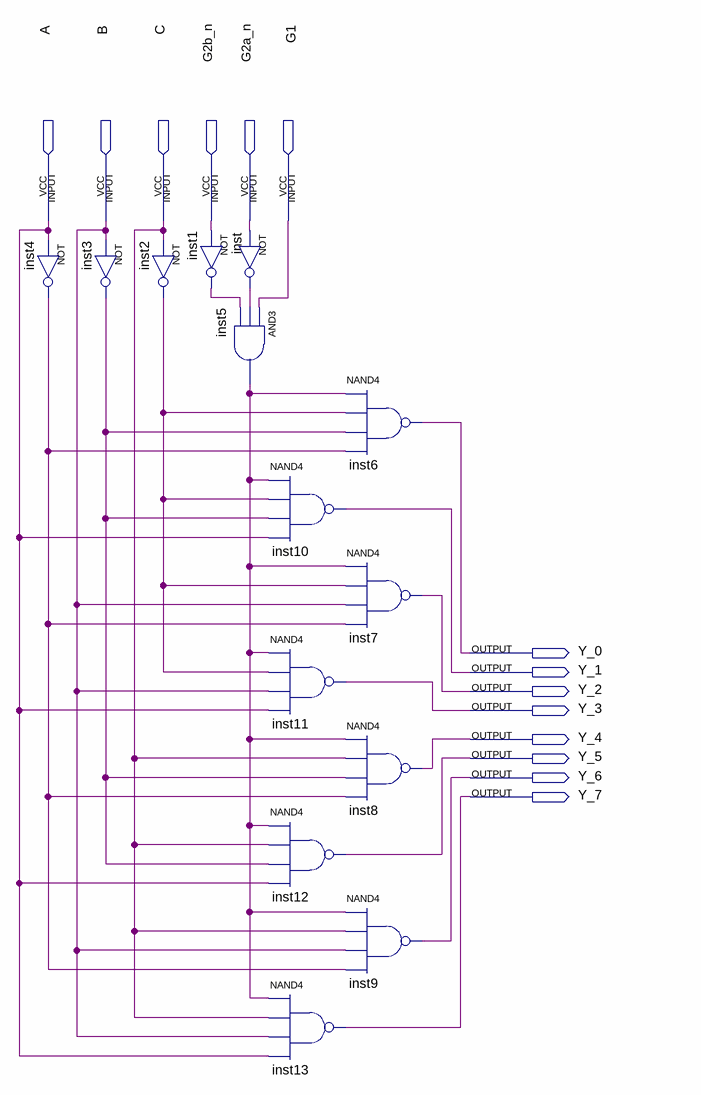
[diagram p0: schematic sheet]
// Quartus schematic 3to8.bdf as structural Verilog: 14 symbols, 14 pins
module \3to8  (
  input  A,
  input  B,
  input  C,
  input  G2b_n,
  input  G2a_n,
  input  G1,
  output Y_0,
  output Y_1,
  output Y_2,
  output Y_3,
  output Y_4,
  output Y_5,
  output Y_6,
  output Y_7
);

  wire inst1_out, inst2_out, inst3_out, inst4_out, inst5_out, inst_out;

  not inst4 (inst4_out, A);
  not inst2 (inst2_out, C);
  not inst3 (inst3_out, B);
  not inst1 (inst1_out, G2b_n);
  and inst5 (inst5_out, G1, inst_out, inst1_out);
  not inst (inst_out, G2a_n);
  nand inst10 (Y_1, inst5_out, inst2_out, inst3_out, A);
  nand inst11 (Y_3, inst5_out, inst2_out, B, A);
  nand inst12 (Y_5, inst5_out, C, inst3_out, A);
  nand inst13 (Y_7, inst5_out, C, B, A);
  nand inst6 (Y_0, inst5_out, inst2_out, inst3_out, inst4_out);
  nand inst7 (Y_2, inst5_out, inst2_out, B, inst4_out);
  nand inst8 (Y_4, inst5_out, C, inst3_out, inst4_out);
  nand inst9 (Y_6, inst5_out, C, B, inst4_out);
endmodule
